# EAGLE design SHIFT REGISTER  IC 74595 (EAGLE 9.6.2)
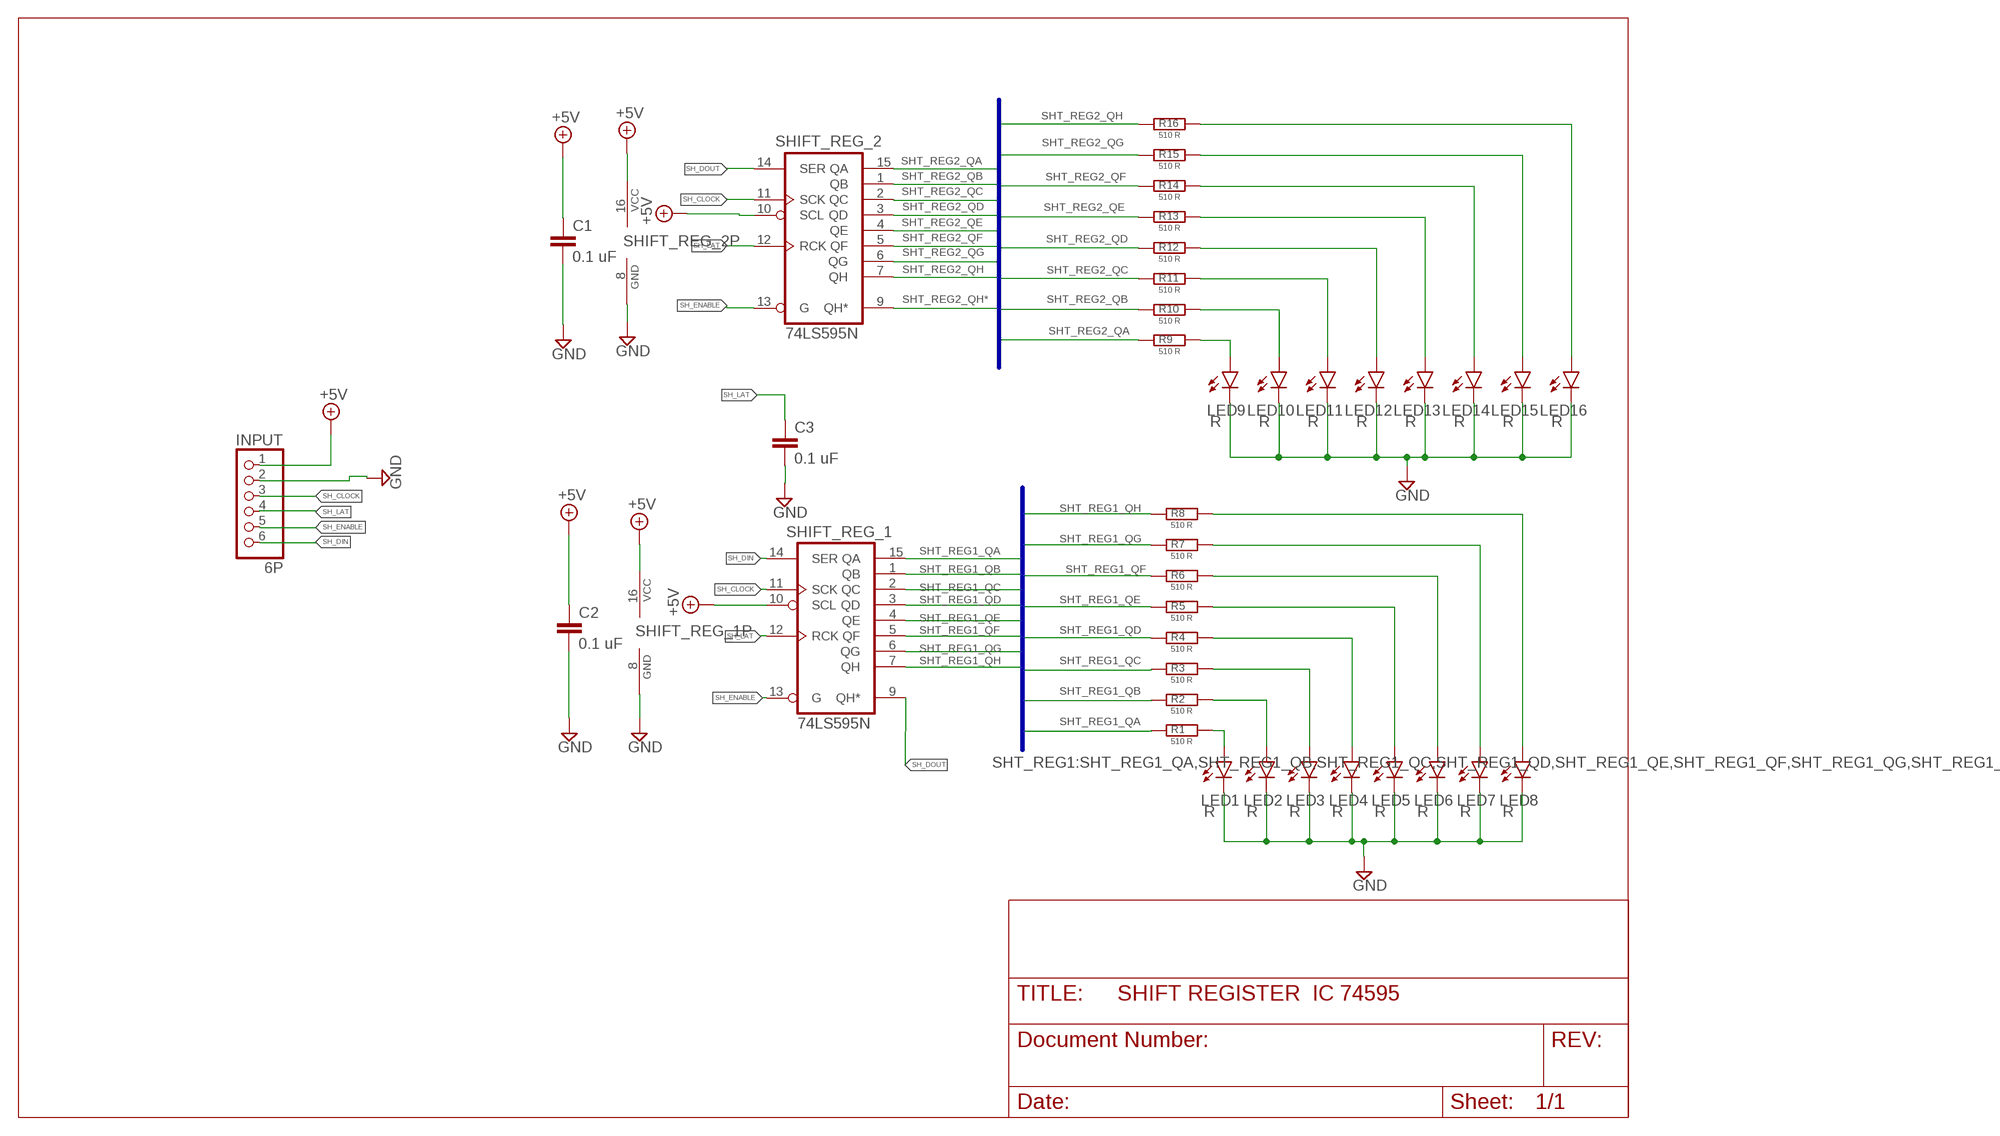
[diagram p0: schematic, sheet 1]

## Parts
C1  0.1 uF  C-EU050-030X075  [C050-030X075]
C2  0.1 uF  C-EU050-030X075  [C050-030X075]
C3  0.1 uF  C-EU050-030X075  [C050-030X075]
INPUT  6P  PINHD-1X6/90  [1X06/90]
LED1  R  LED5MM  [LED5MM]
LED2  R  LED5MM  [LED5MM]
LED3  R  LED5MM  [LED5MM]
LED4  R  LED5MM  [LED5MM]
LED5  R  LED5MM  [LED5MM]
LED6  R  LED5MM  [LED5MM]
LED7  R  LED5MM  [LED5MM]
LED8  R  LED5MM  [LED5MM]
LED9  R  LED5MM  [LED5MM]
LED10  R  LED5MM  [LED5MM]
LED11  R  LED5MM  [LED5MM]
LED12  R  LED5MM  [LED5MM]
LED13  R  LED5MM  [LED5MM]
LED14  R  LED5MM  [LED5MM]
LED15  R  LED5MM  [LED5MM]
LED16  R  LED5MM  [LED5MM]
R1  510 R  R-EU_0207/10  [0207/10]
R2  510 R  R-EU_0207/10  [0207/10]
R3  510 R  R-EU_0207/10  [0207/10]
R4  510 R  R-EU_0207/10  [0207/10]
R5  510 R  R-EU_0207/10  [0207/10]
R6  510 R  R-EU_0207/10  [0207/10]
R7  510 R  R-EU_0207/10  [0207/10]
R8  510 R  R-EU_0207/10  [0207/10]
R9  510 R  R-EU_0207/10  [0207/10]
R10  510 R  R-EU_0207/10  [0207/10]
R11  510 R  R-EU_0207/10  [0207/10]
R12  510 R  R-EU_0207/10  [0207/10]
R13  510 R  R-EU_0207/10  [0207/10]
R14  510 R  R-EU_0207/10  [0207/10]
R15  510 R  R-EU_0207/10  [0207/10]
R16  510 R  R-EU_0207/10  [0207/10]
SHIFT_REG_1  74LS595N  [DIL16]
SHIFT_REG_2  74LS595N  [DIL16]

## Nets
+5V: C1.1 C2.1 INPUT.1 SHIFT_REG_1.10(SCL) SHIFT_REG_1.16(VCC) SHIFT_REG_2.10(SCL) SHIFT_REG_2.16(VCC)
GND: C1.2 C2.2 C3.2 INPUT.2 LED1.K(C) LED2.K(C) LED3.K(C) LED4.K(C) LED5.K(C) LED6.K(C) LED7.K(C) LED8.K(C) LED9.K(C) LED10.K(C) LED11.K(C) LED12.K(C) LED13.K(C) LED14.K(C) LED15.K(C) LED16.K(C) SHIFT_REG_1.8(GND) SHIFT_REG_2.8(GND)
N$3: LED1.A R1.2
N$4: LED2.A R2.2
N$5: LED3.A R3.2
N$6: LED4.A R4.2
N$7: LED5.A R5.2
N$8: LED6.A R6.2
N$9: LED7.A R7.2
N$10: LED8.A R8.2
N$11: LED9.A R9.2
N$12: LED10.A R10.2
N$13: LED11.A R11.2
N$14: LED12.A R12.2
N$15: LED13.A R13.2
N$16: LED14.A R14.2
N$17: LED15.A R15.2
N$18: LED16.A R16.2
SH_CLOCK: INPUT.3 SHIFT_REG_1.11(SCK) SHIFT_REG_2.11(SCK)
SH_DIN: INPUT.6 SHIFT_REG_1.14(SER)
SH_DOUT: SHIFT_REG_1.9(QH*) SHIFT_REG_2.14(SER)
SH_ENABLE: INPUT.5 SHIFT_REG_1.13(G) SHIFT_REG_2.13(G)
SH_LAT: C3.1 INPUT.4 SHIFT_REG_1.12(RCK) SHIFT_REG_2.12(RCK)
SHT_REG1_QA: R1.1 SHIFT_REG_1.15(QA)
SHT_REG1_QB: R2.1 SHIFT_REG_1.1(QB)
SHT_REG1_QC: R3.1 SHIFT_REG_1.2(QC)
SHT_REG1_QD: R4.1 SHIFT_REG_1.3(QD)
SHT_REG1_QE: R5.1 SHIFT_REG_1.4(QE)
SHT_REG1_QF: R6.1 SHIFT_REG_1.5(QF)
SHT_REG1_QG: R7.1 SHIFT_REG_1.6(QG)
SHT_REG1_QH: R8.1 SHIFT_REG_1.7(QH)
SHT_REG2_QA: R9.1 SHIFT_REG_2.15(QA)
SHT_REG2_QB: R10.1 SHIFT_REG_2.1(QB)
SHT_REG2_QC: R11.1 SHIFT_REG_2.2(QC)
SHT_REG2_QD: R12.1 SHIFT_REG_2.3(QD)
SHT_REG2_QE: R13.1 SHIFT_REG_2.4(QE)
SHT_REG2_QF: R14.1 SHIFT_REG_2.5(QF)
SHT_REG2_QG: R15.1 SHIFT_REG_2.6(QG)
SHT_REG2_QH: R16.1 SHIFT_REG_2.7(QH)
SHT_REG2_QH*: SHIFT_REG_2.9(QH*)

## Buses
SHT_REG2:SHT_REG2_QA,SHT_REG2_QB,SHT_REG2_QC,SHT_REG2_QD,SHT_REG2_QE,SHT_REG2_QF,SHT_REG2_QG,SHT_REG2_QH,SHT_REG2_QH*
SHT_REG1:SHT_REG1_QA,SHT_REG1_QB,SHT_REG1_QC,SHT_REG1_QD,SHT_REG1_QE,SHT_REG1_QF,SHT_REG1_QG,SHT_REG1_QH,SHT_REG1_QH*

## Library data of the parts
C1-C3 = rcl:C-EU: CAPACITOR, European symbol; SPICEPREFIX: C
INPUT = pinhead:PINHD-1X6: PIN HEADER
LED1-LED16 = led:LED: LED OSRAM: - CHIPLED LG R971, LG N971, LY N971, LG Q971, LY Q971, LO R971, LY R971 LH N974, LH R974 LS Q976, LO Q976, LY Q976 LO Q996 - Hyper CHIPLED LW Q18S LB Q993, LB Q99A, LB R99A - SideLED LS A670, LO A670, LY A670, LG A670, LP A670 LB A673, LV A673, LT A673, LW A673 LH A674 LY A675 LS A676, LA A676, LO A676, LY A676, LW A676 LS A679, LY A679, LG A679 - Hyper Micro SIDELED® LS Y876, LA Y876, LO Y876, LY Y876 LT Y87S - SmartLED LW L88C, LW L88S LB L89C, LB L89S, LG L890 LS L89K, LO L89K, LY L89K LS L896, LA L896, LO L896, LY L896 - TOPLED LS T670, LO T670, LY T670, LG T670, LP T670 LSG T670, LSP T670, LSY T670, LOP T670, LYG T670 LG T671, LOG T671, LSG T671 LB T673, LV T673, LT T673, LW T673 LH T674 LS T676, LA T676, LO T676, LY T676, LB T676, LH T676, LSB T676, LW T676 LB T67C, LV T67C, LT T67C, LS T67K, LO T67K, LY T67K, LW E67C LS E67B, LA E67B, LO E67B, LY E67B, LB E67C, LV E67C, LT E67C LW T67C LS T679, LY T679, LG T679 LS T770, LO T770, LY T770, LG T770, LP T770 LB T773, LV T773, LT T773, LW T773 LH T774 LS E675, LA E675, LY E675, LS T675 LS T776, LA T776, LO T776, LY T776, LB T776 LHGB T686 LT T68C, LB T68C - Hyper Mini TOPLED® LB M676 - Mini TOPLED Santana® LG M470 LS M47K, LO M47K, LY M47K Source: http://www.osram.convergy.de LUXEON: - LUMILED® LXK2-PW12-R00, LXK2-PW12-S00, LXK2-PW14-U00, LXK2-PW14-V00 LXK2-PM12-R00, LXK2-PM12-S00, LXK2-PM14-U00 LXK2-PE12-Q00, LXK2-PE12-R00, LXK2-PE12-S00, LXK2-PE14-T00, LXK2-PE14-U00 LXK2-PB12-K00, LXK2-PB12-L00, LXK2-PB12-M00, LXK2-PB14-N00, LXK2-PB14-P00, LXK2-PB14-Q00 LXK2-PR12-L00, LXK2-PR12-M00, LXK2-PR14-Q00, LXK2-PR14-R00 LXK2-PD12-Q00, LXK2-PD12-R00, LXK2-PD12-S00 LXK2-PH12-R00, LXK2-PH12-S00 LXK2-PL12-P00, LXK2-PL12-Q00, LXK2-PL12-R00 Source: www.luxeon.com KINGBRIGHT: KA-3528ASYC Source: www.kingbright.com
R1-R16 = rcl:R-EU_: RESISTOR, European symbol; SPICEPREFIX: R
SHIFT_REG_1 SHIFT_REG_2 = 74xx-us:74*595: 8-bit SHIFT REGISTER, output latch

## Board
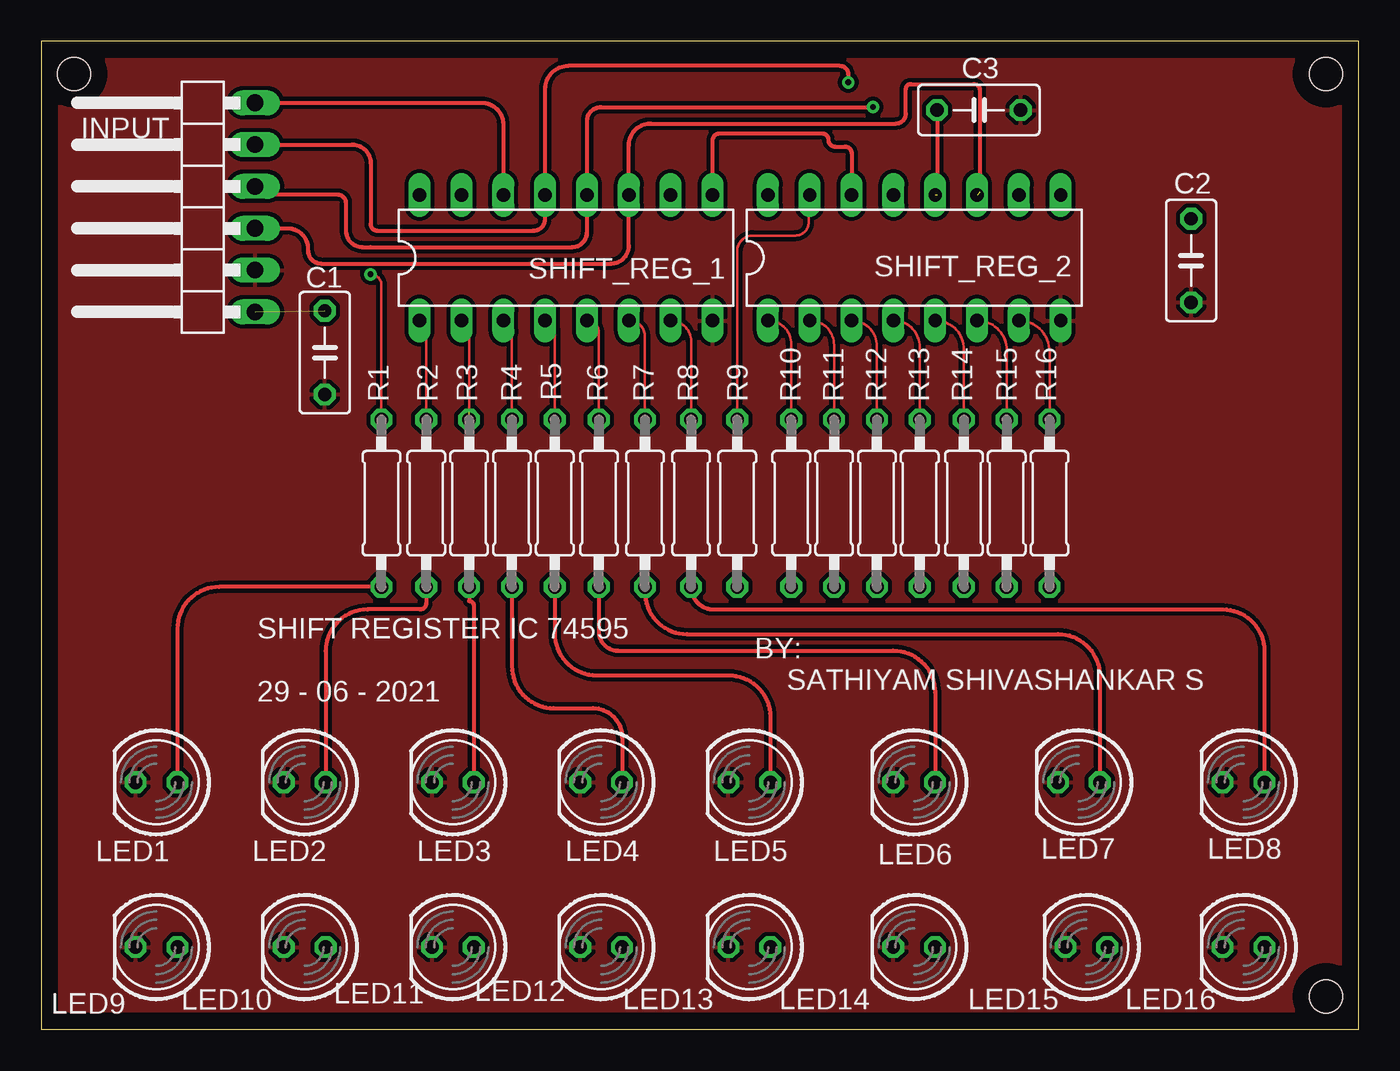
[diagram p1: board, top side]
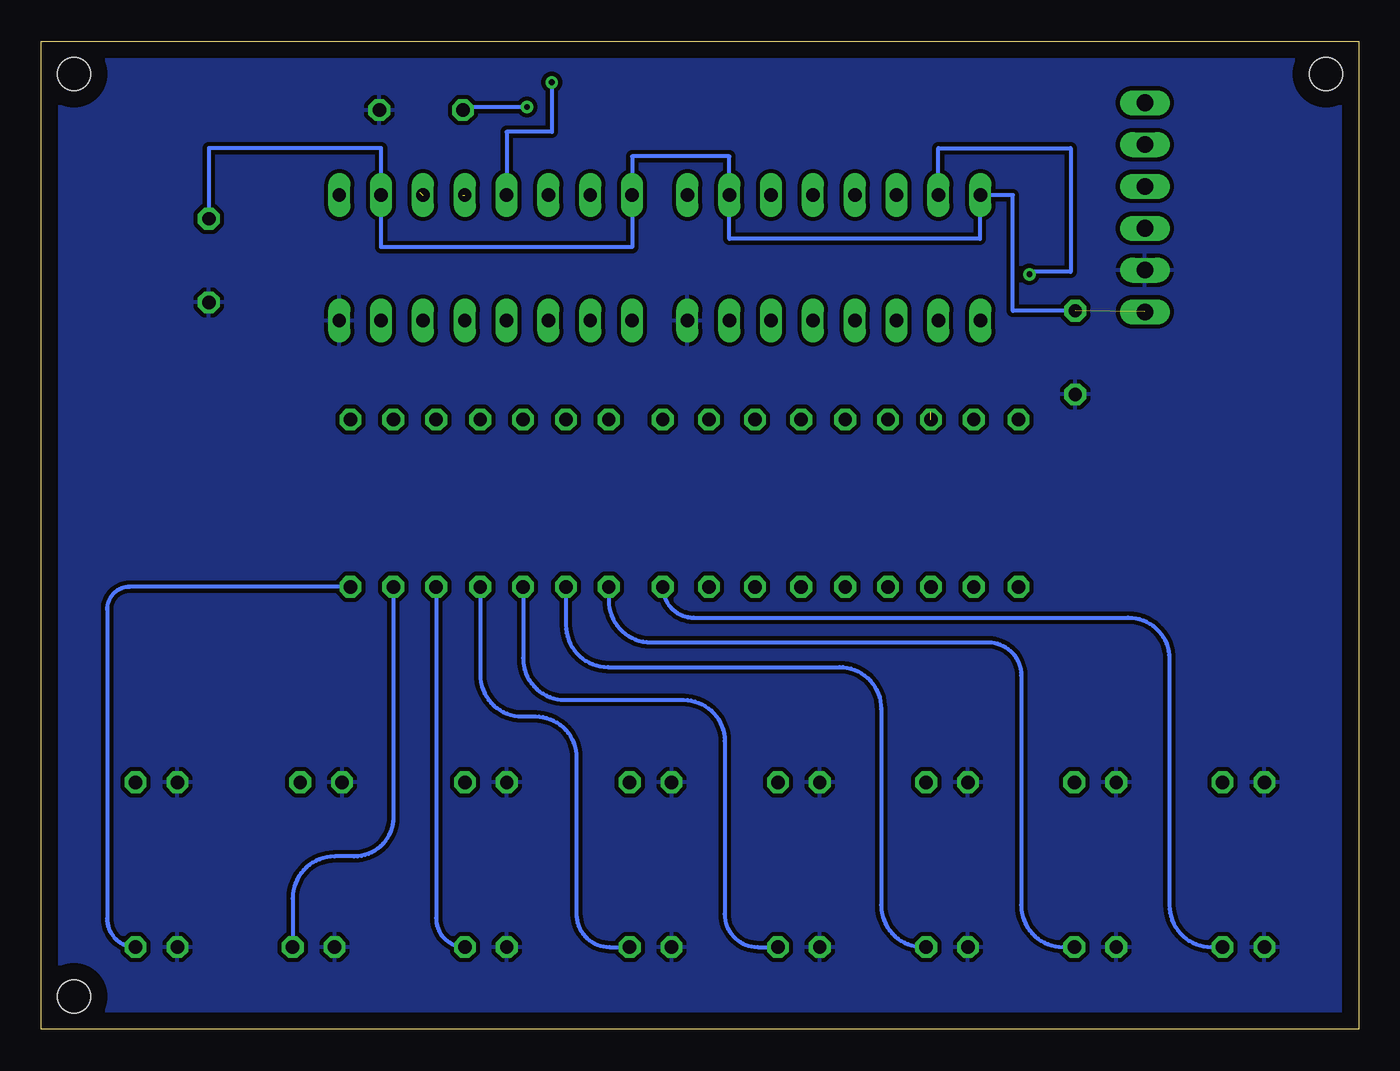
[diagram p2: board, bottom side, seen from below]

Size 80 x 60 mm. Coordinates in mm from the lower left corner, seen from the top.
Outline: 0,0 80,0 80,60 0,60 0,0
Copper layers (1*16): Top 0.035mm / dielectric 1.5mm / Bottom 0.035mm
Design rules "default": minimum track width 6mil, minimum drill 0.35mm, track to track 6mil, track to pad 6mil, pad to pad 6mil, via to via 6mil, smd to smd 6mil, copper to edge 40mil, drill to drill 6mil, minimum pad ring 10mil, minimum via ring 8mil, stop-mask expansion 4mil, vias tented up to drill 0mil, thermal gap 10mil
Holes 2 mm at 2,58 78,58 78,2

### Footprints (pad centres in the part's own frame; a part is rotated, then mirrored left to right if it is on the bottom)
C050-030X075 = drill 0.813 octagon: 1 -2.54,0; 2 2.54,0
1X06/90 = drill 1.016 long: 1 -6.35,-3.81; 2 -3.81,-3.81; 3 -1.27,-3.81; 4 1.27,-3.81; 5 3.81,-3.81; 6 6.35,-3.81
LED5MM = drill 0.813 octagon: A -1.27,0; K 1.27,0
0207/10 = drill 0.813 octagon: 1 -5.08,0; 2 5.08,0
DIL16 = drill 0.813 long: 1 -8.89,-3.81; 2 -6.35,-3.81; 3 -3.81,-3.81; 4 -1.27,-3.81; 5 1.27,-3.81; 6 3.81,-3.81; 7 6.35,-3.81; 8 8.89,-3.81; 9 8.89,3.81; 10 6.35,3.81; 11 3.81,3.81; 12 1.27,3.81; 13 -1.27,3.81; 14 -3.81,3.81; 15 -6.35,3.81; 16 -8.89,3.81

### Placement (x,y rotation side)
C1  17.22,41.09 270 top
C2  69.82,46.68 270 top
C3  56.93,55.82 0 top
INPUT  9.18,49.91 90 top
LED1  7,15 180 top
LED2  16,15 180 top
LED3  25,15 180 top
LED4  34,15 180 top
LED5  43,15 180 top
LED6  53,15 180 top
LED7  63,15 180 top
LED8  73,15 180 top
LED9  7,5 180 top
LED10  16,5 180 top
LED11  25,5 180 top
LED12  34,5 180 top
LED13  43,5 180 top
LED14  53,5 180 top
LED15  63.46,5 180 top
LED16  73,5 180 top
R1  20.66,31.95 270 top
R2  23.38,31.95 270 top
R3  25.98,31.95 270 top
R4  28.58,31.95 270 top
R5  31.18,31.95 270 top
R6  33.86,31.95 270 top
R7  36.66,31.95 270 top
R8  39.46,31.95 270 top
R9  42.26,31.95 270 top
R10  45.54,31.95 270 top
R11  48.14,31.95 270 top
R12  50.74,31.95 270 top
R13  53.34,31.95 270 top
R14  56.02,31.95 270 top
R15  58.62,31.95 270 top
R16  61.22,31.95 270 top
SHIFT_REG_1  31.87,46.85 0 top
SHIFT_REG_2  53.01,46.85 0 top

### Tracks (layer width: path | path; a pad name or v marks a point on that pad's centre or on a via)
+5V  (1 unrouted)
  Bottom 0.254: C2.1 69.82,53.5 59.36,53.5 SHIFT_REG_2.10 59.36,47.5 44.12,47.5 SHIFT_REG_2.16 44.12,53 38.22,53 SHIFT_REG_1.10 38.22,48 23,48 23,50.66 SHIFT_REG_1.16 21,50.66 21,43.63 C1.1
GND
  pour Top (isolate 0.254): 0.5,59.5 79.5,59.5 79.5,0.5 0.5,0.5 0.5,2
  pour Bottom (isolate 0.254): 0.5,59.5 79.5,59.5 79.5,0.5 78.5,0.5 0.5,0.5 0.5,1
N$3
  Top 0.254: R1.2 10.81,26.87 arc90 8.27,24.33 LED1.A
N$4
  Top 0.254: R2.2 23.38,25.88 arc-90 23,25.5 19.81,25.5 arc90 17.27,22.96 LED2.A
N$5
  Top 0.254: R3.2 25.98,26.02 arc90 26,26 arc-90 26.27,25.73 LED3.A
N$6
  Top 0.254: R4.2 28.58,22.04 arc90 31.12,19.5 33.5,19.5 arc-90 35.27,17.73 LED4.A
N$7
  Top 0.254: R5.2 31.18,24.04 arc90 33.72,21.5 41.73,21.5 arc-90 44.27,18.96 LED5.A
N$8
  Top 0.254: R6.2 33.86,24.14 arc90 35,23 51.73,23 arc-90 54.27,20.46 LED6.A
N$9
  Top 0.254: R7.2 36.66,26.54 arc90 39.2,24 61.73,24 arc-90 64.27,21.46 LED7.A
N$10
  Top 0.254: R8.2 arc90 40.83,25.5 71.73,25.5 arc-90 74.27,22.96 LED8.A
N$11
  Bottom 0.254: R9.2 arc-90 40.39,25 14,25 arc90 11.5,22.5 11.5,7.54 arc-90 8.96,5 LED9.A
N$12
  Bottom 0.254: R10.2 45.54,26.04 arc-90 43,23.5 22.5,23.5 arc90 20.5,21.5 20.5,7.54 arc-90 17.96,5 LED10.A
N$13
  Bottom 0.254: R11.2 48.14,24.54 arc-90 45.6,22 31.54,22 arc90 29,19.46 29,7.54 arc-90 26.46,5 LED11.A
N$14
  Bottom 0.254: R12.2 50.74,22.54 arc-90 48.2,20 41,20 arc90 38.5,17.5 38.5,7 arc-90 36.5,5 LED12.A
N$15
  Bottom 0.254: R13.2 53.34,21.54 arc-90 50.8,19 50,19 arc90 47.5,16.5 47.5,7 arc-90 45.5,5 LED13.A
N$16
  Bottom 0.254: R14.2 56.02,6.75 arc-90 LED14.A
N$17
  Bottom 0.254: R15.2 58.62,12.88 arc90 61,10.5 62.19,10.5 arc-90 64.73,7.96 LED15.A
N$18
  Bottom 0.254: R16.2 74.63,26.87 arc-90 76,25.5 76,6.73 arc-90 LED16.A
SH_CLOCK  (1 unrouted)
  Top 0.254: 57,50.84 57,57 arc90 56.6,57.4 52.8,57.4 arc90 52.5,57.1 52.5,55.6 arc-90 51.9,55 37,55 arc90 35.68,53.68 SHIFT_REG_1.11 35.68,47.58 arc-90 34.6,46.5 17,46.5 arc-90 16.2,47.3 16.2,47.4 arc90 14.96,48.64 INPUT.3
SH_DIN
  Top 0.254: INPUT.6 26.74,56.26 arc-90 28.06,54.94 SHIFT_REG_1.14
SH_DOUT
  Top 0.254: SHIFT_REG_2.14 49.2,53.2 arc90 48.8,53.6 48.2,53.6 arc-90 47.8,54 arc90 47.4,54.4 41.2,54.4 arc90 40.76,53.96 SHIFT_REG_1.9
SH_ENABLE  (via drill 0.35)
  Top 0.254: INPUT.5 18.88,53.72 arc-90 20,52.6 20,48.9 arc90 20.4,48.5 29.9,48.5 arc90 30.6,49.2 SHIFT_REG_1.13 30.6,57.1 arc-90 32,58.5 48.5,58.5 arc-90 49,58 v49,57.5
  Bottom 0.254: v49,57.5 49,54.5 51.74,54.5 SHIFT_REG_2.13
SH_LAT  (via drill 0.35)  (1 unrouted)
  Top 0.254: v50.5,56 34,56 arc90 33.14,55.14 SHIFT_REG_1.12 33.14,48.4 arc-90 32.24,47.5 20,47.5 19.5,47.5 arc-90 18.5,48.5 18.5,50.18 arc90 18,50.68 13.49,50.68 INPUT.4 | C3.1 54.39,50.66
  Bottom 0.254: v50.5,56 54.39,56 C3.1
SHT_REG1_QA  (via drill 0.35)
  Top 0.152: v20,45.84 arc-90 20.66,45.18 R1.1
  Bottom 0.254: SHIFT_REG_1.15 25.52,53.5 17.5,53.5 17.5,46 20,46 v20,45.84
SHT_REG1_QB
  Top 0.152: SHIFT_REG_1.1 arc-90 23.38,42.64 R2.1
SHT_REG1_QC  (1 unrouted)
  Top 0.152: SHIFT_REG_1.2 arc-90 25.98,42.58 R3.1
  Top 0.254: 25.98,37.51 25.92,37.57
SHT_REG1_QD
  Top 0.152: SHIFT_REG_1.3 arc-90 28.58,42.52 R4.1
SHT_REG1_QE
  Top 0.152: SHIFT_REG_1.4 arc-90 31.18,42.46 R5.1
SHT_REG1_QF
  Top 0.152: SHIFT_REG_1.5 arc-90 33.86,42.32 R6.1
SHT_REG1_QG
  Top 0.152: SHIFT_REG_1.6 arc-90 36.66,42.06 R7.1
SHT_REG1_QH
  Top 0.152: SHIFT_REG_1.7 arc-90 39.46,41.8 R8.1
SHT_REG2_QA
  Top 0.152: R9.1 42.26,47.26 arc-90 43.2,48.2 45.8,48.2 arc90 46.6,49 46.6,50.6 arc-90 SHIFT_REG_2.15
SHT_REG2_QB
  Top 0.152: SHIFT_REG_2.1 arc-90 45.54,41.62 R10.1
SHT_REG2_QC
  Top 0.152: SHIFT_REG_2.2 arc-90 48.14,41.56 R11.1
SHT_REG2_QD
  Top 0.152: SHIFT_REG_2.3 arc-90 50.74,41.5 R12.1
SHT_REG2_QE
  Top 0.152: SHIFT_REG_2.4 arc-90 53.34,41.44 R13.1
SHT_REG2_QF
  Top 0.152: SHIFT_REG_2.5 arc-90 56.02,41.3 R14.1
SHT_REG2_QG
  Top 0.152: SHIFT_REG_2.6 arc-90 58.62,41.24 R15.1
SHT_REG2_QH
  Top 0.152: SHIFT_REG_2.7 arc-90 61.22,41.18 R16.1

### Text on the board
tNames: BY: / SATHIYAM SHIVASHANKAR S | SHIFT REGISTER IC 74595 / / 29 - 06 - 2021